# EAGLE schematic Module_DIO (EAGLE 9.2.1)

## Sheet 1 of 3
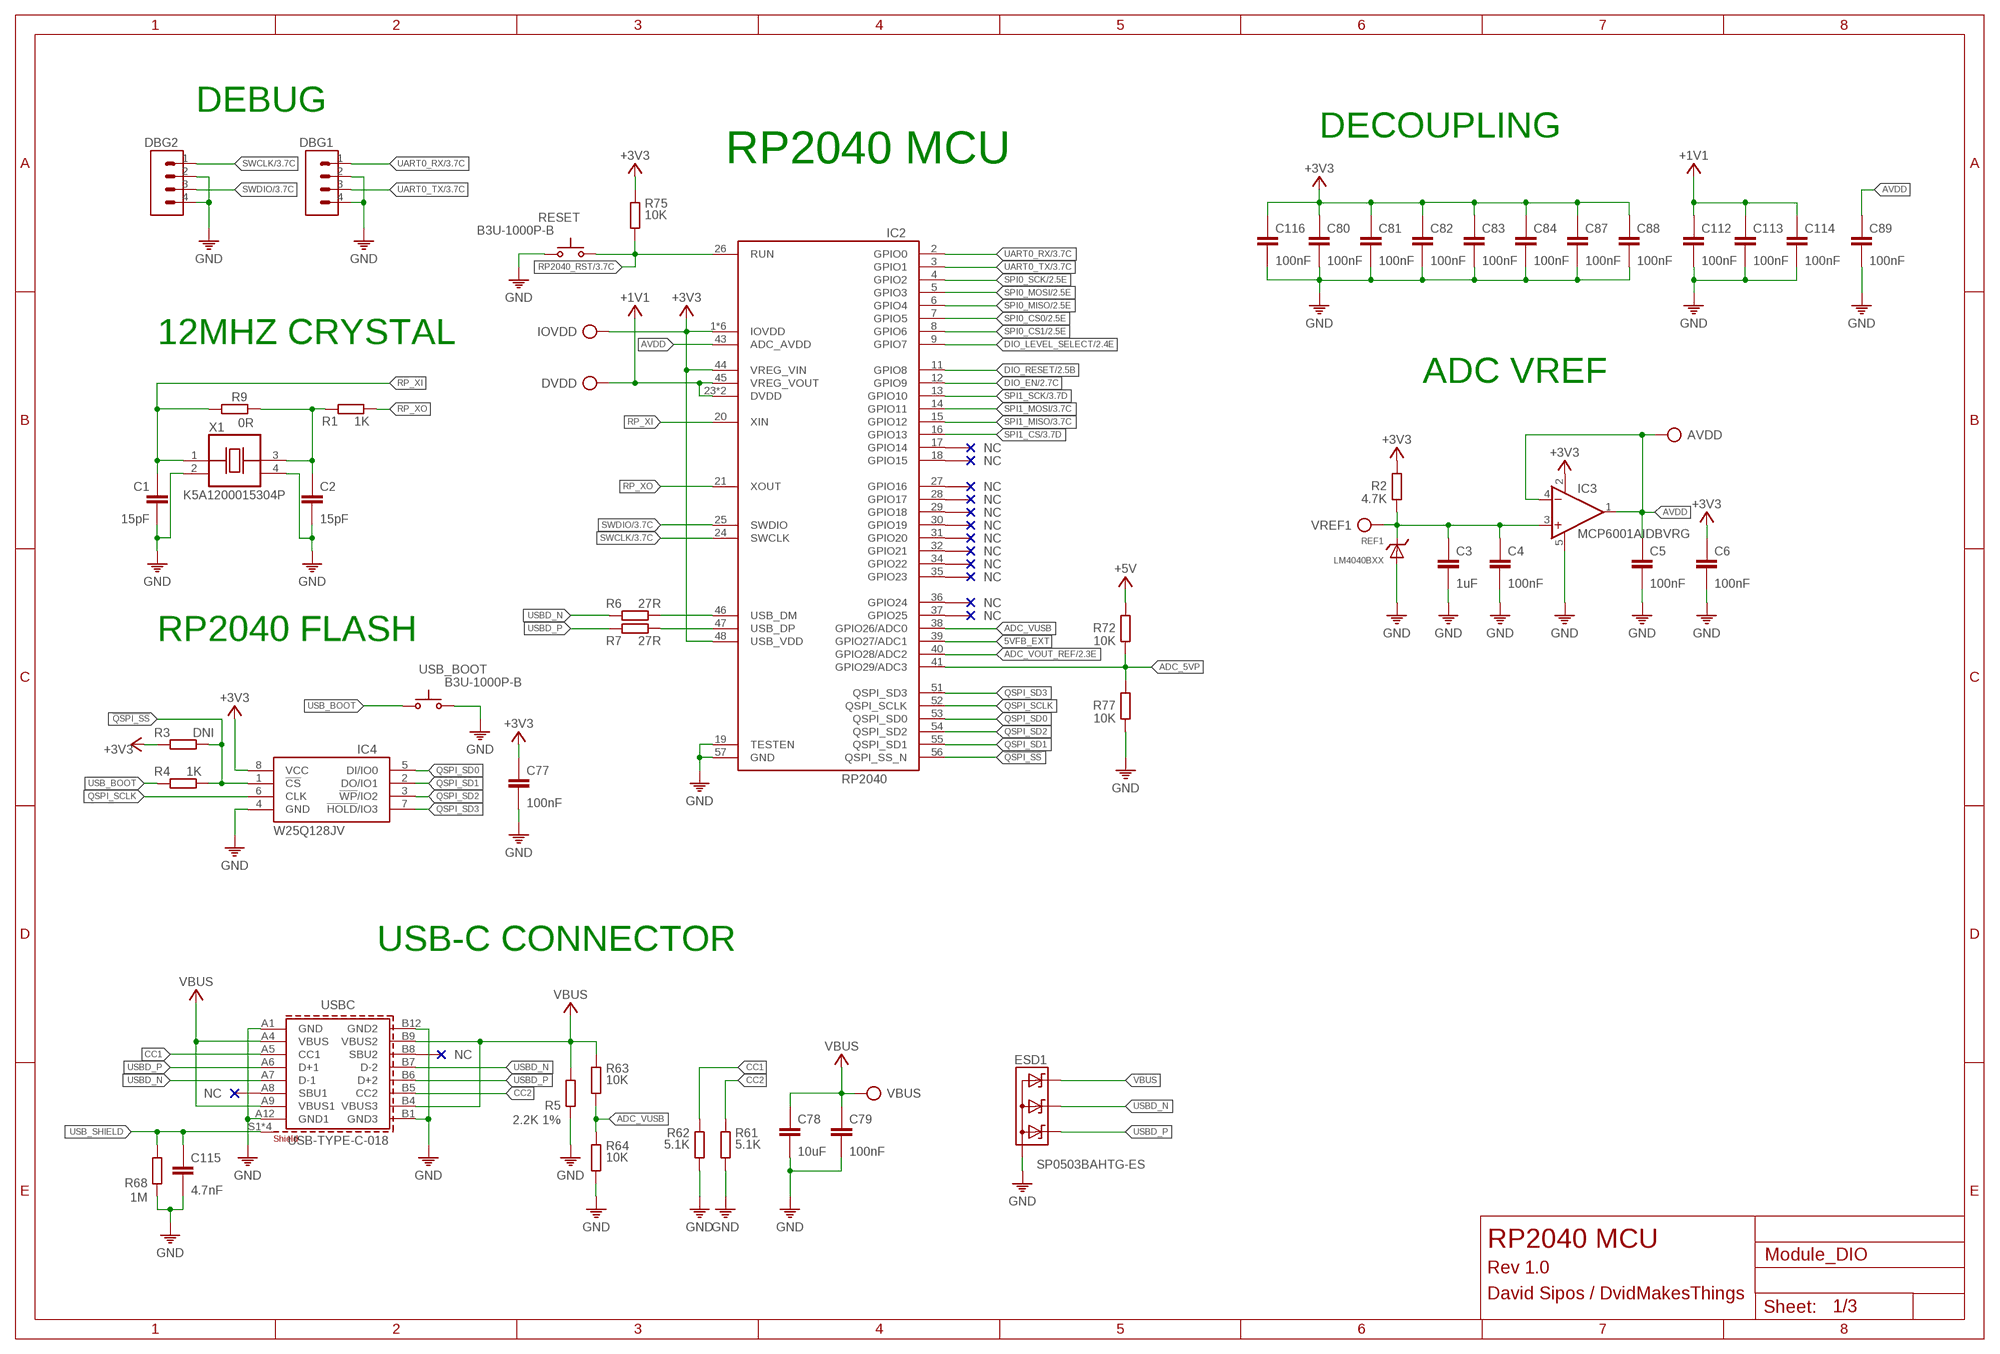
[diagram p0: schematic, sheet 1]

### Parts
AVDD  TP  [TP]
C1  15pF  C-0402  [C0402]
C2  15pF  C-0402  [C0402]
C3  1uF  C-0402  [C0402]
C4  100nF  C-0402  [C0402]
C5  100nF  C-0402  [C0402]
C6  100nF  C-0402  [C0402]
C77  100nF  C-0402  [C0402]
C78  10uF  C0805  [0805]
C79  100nF  C0402  [0402]
C80  100nF  C-0402  [C0402]
C81  100nF  C-0402  [C0402]
C82  100nF  C-0402  [C0402]
C83  100nF  C-0402  [C0402]
C84  100nF  C-0402  [C0402]
C87  100nF  C-0402  [C0402]
C88  100nF  C-0402  [C0402]
C89  100nF  C-0402  [C0402]
C112  100nF  C-0402  [C0402]
C113  100nF  C-0402  [C0402]
C114  100nF  C-0402  [C0402]
C115  4.7nF  C0402  [0402]
C116  100nF  C-0402  [C0402]
DBG1  CON-1X4  [1X4]
DBG2  CON-1X4  [1X4]
DVDD  TP  [TP]
ESD1  SP0503BAHTG-ES  SP0503BAHT  [SOT143]
IC2  RP2040  [QFN40P700X700X100-57T510]
IC3  MCP6001AIDBVRG  MCP6001RT  [SOT23-5]
IC4  W25Q128JVPIQ  W25Q128JVP  [SON127P600X500X75-8N]
IOVDD  TP  [TP]
R1  1K  R0402  [0402]
R2  4.7K  R0402  [0402]
R3  DNI  R0402  [0402]
R4  1K  R0402  [0402]
R5  2.2K 1%  R0402  [0402]
R6  27R  R0402  [0402]
R7  27R  R0402  [0402]
R9  0R  R0402  [0402]
R61  5.1K  R0402  [0402]
R62  5.1K  R0402  [0402]
R63  10K  R0402  [0402]
R64  10K  R0402  [0402]
R68  1M  R0402  [0402]
R72  10K  R0402  [0402]
R75  10K  R0402  [0402]
R77  10K  R0402  [0402]
REF1  LM4040BXX  [SOT23]
RESET  B3U-1000P-B  SWITCH-OMRON_B3U-1000P  [SWITCH-OMRON_B3U-1000P]
USB_BOOT  B3U-1000P-B  SWITCH-OMRON_B3U-1000P  [SWITCH-OMRON_B3U-1000P]
USBC  USB-TYPE-C-018  629722000214  [629722000214]
VBUS  TP  [TP]
VREF1  TP  [TP]
X1  K5A1200015304P  CRYSTAL  [OSCCC500X320X130]

### Nets
5VFB_EXT: IC2.39(GPIO27/ADC1)
!QSPI_SS: IC2.56(QSPI_SS_N) IC4.1(!CS) R3.1 R4.2
+1V1: C112.1 C113.1 C114.1 DVDD.TP IC2.23(DVDD) IC2.45(VREG_VOUT) IC2.50(DVDD)
+3V3: C6.1 C77.1 C80.1 C81.1 C82.1 C83.1 C84.1 C87.1 C88.1 C116.1 IC2.1(IOVDD) IC2.10(IOVDD) IC2.22(IOVDD) IC2.33(IOVDD) IC2.42(IOVDD) IC2.44(VREG_VIN) IC2.48(USB_VDD) IC2.49(IOVDD) IC3.2(V+) IC4.8(VCC) IOVDD.TP R2.2 R3.2 R75.1 ; also sheet 2,3
+5V: R72.2 ; also sheet 2,3
ADC_5VP: IC2.41(GPIO29/ADC3) R72.1 R77.2
ADC_VOUT_REF: IC2.40(GPIO28/ADC2) ; also sheet 2
ADC_VUSB: IC2.38(GPIO26/ADC0) R63.2 R64.1
AVDD: AVDD.TP C5.1 C89.1 IC2.43(ADC_AVDD) IC3.1(OUT) IC3.4(-IN)
CC1: R62.1 USBC.A5(CC1)
CC2: R61.1 USBC.B5(CC2)
DIO_EN: IC2.12(GPIO9) ; also sheet 2,3
DIO_LEVEL_SELECT: IC2.9(GPIO7) ; also sheet 2,3
DIO_RESET: IC2.11(GPIO8) ; also sheet 2,3
GND: C1.2 C2.2 C3.2 C4.2 C5.2 C6.2 C77.2 C78.2 C79.2 C80.2 C81.2 C82.2 C83.2 C84.2 C87.2 C88.2 C89.2 C112.2 C113.2 C114.2 C115.2 C116.2 DBG1.2 DBG1.4 DBG2.2 DBG2.4 ESD1.1(A) IC2.19(TESTEN) IC2.57(GND) IC3.5(V-) IC4.4(GND) R5.2 R61.2 R62.2 R64.2 R68.2 R77.1 REF1.2(A) REF1.3(A) RESET.2(S) USB_BOOT.2(S) USBC.A1(GND) USBC.A12(GND1) USBC.B1(GND3) USBC.B12(GND2) X1.2(VSS) X1.4(VDD) ; also sheet 2,3
N$1: C2.1 R1.1 R9.2 X1.3(OUT)
QSPI_SCLK: IC2.52(QSPI_SCLK) IC4.6(CLK)
QSPI_SD0: IC2.53(QSPI_SD0) IC4.5(DI/IO0)
QSPI_SD1: IC2.55(QSPI_SD1) IC4.2(DO/IO1)
QSPI_SD2: IC2.54(QSPI_SD2) IC4.3(!WP!/IO2)
QSPI_SD3: IC2.51(QSPI_SD3) IC4.7(!HOLD!/IO3)
RP2040_RST: IC2.26(RUN) R75.2 RESET.1(P) ; also sheet 3
RP_USBD_N [90R_DIFFPAIR]: IC2.46(USB_DM) R6.2
RP_USBD_P [90R_DIFFPAIR]: IC2.47(USB_DP) R7.2
RP_XI: C1.1 IC2.20(XIN) R9.1 X1.1(CON)
RP_XO: IC2.21(XOUT) R1.2
SPI0_CS0: IC2.7(GPIO5) ; also sheet 2,3
SPI0_CS1: IC2.8(GPIO6) ; also sheet 2,3
SPI0_MISO: IC2.6(GPIO4) ; also sheet 2,3
SPI0_MOSI: IC2.5(GPIO3) ; also sheet 2,3
SPI0_SCK: IC2.4(GPIO2) ; also sheet 2,3
SPI1_CS: IC2.16(GPIO13) ; also sheet 3
SPI1_MISO: IC2.15(GPIO12) ; also sheet 3
SPI1_MOSI: IC2.14(GPIO11) ; also sheet 3
SPI1_SCK: IC2.13(GPIO10) ; also sheet 3
SWCLK: DBG2.1 IC2.24(SWCLK) ; also sheet 3
SWDIO: DBG2.3 IC2.25(SWDIO) ; also sheet 3
UART0_RX: DBG1.1 IC2.2(GPIO0) ; also sheet 3
UART0_TX: DBG1.3 IC2.3(GPIO1) ; also sheet 3
USB_BOOT: R4.1 USB_BOOT.1(P)
USB_SHIELD: C115.1 R68.1 USBC.S1(SHIELD) USBC.S2(SHIELD) USBC.S3(SHIELD) USBC.S4(SHIELD)
USBD_N [90R_DIFFPAIR]: ESD1.3(C2) R6.1 USBC.A7(D-1) USBC.B7(D-2)
USBD_P [90R_DIFFPAIR]: ESD1.2(C1) R7.1 USBC.A6(D+1) USBC.B6(D+2)
VBUS: C78.1 C79.1 ESD1.4(C3) R5.1 R63.1 USBC.A4(VBUS) USBC.A9(VBUS1) USBC.B4(VBUS3) USBC.B9(VBUS2) VBUS.TP ; also sheet 3
VREF: C3.1 C4.1 IC3.3(+IN) R2.1 REF1.1(C) VREF1.TP
Unconnected: IC2.17(GPIO14) IC2.18(GPIO15) IC2.27(GPIO16) IC2.28(GPIO17) IC2.29(GPIO18) IC2.30(GPIO19) IC2.31(GPIO20) IC2.32(GPIO21) IC2.34(GPIO22) IC2.35(GPIO23) IC2.36(GPIO24) IC2.37(GPIO25) USBC.A8(SBU1) USBC.B8(SBU2)

### Notes on the sheet
- DEBUG
- DECOUPLING
- RP2040 MCU
- 12MHZ CRYSTAL
- ADC VREF
- RP2040 FLASH
- USB-C CONNECTOR
- RP2040 MCU
- Rev 1.0
- David Sipos / DvidMakesThings

## Sheet 2 of 3: DIGITAL IO
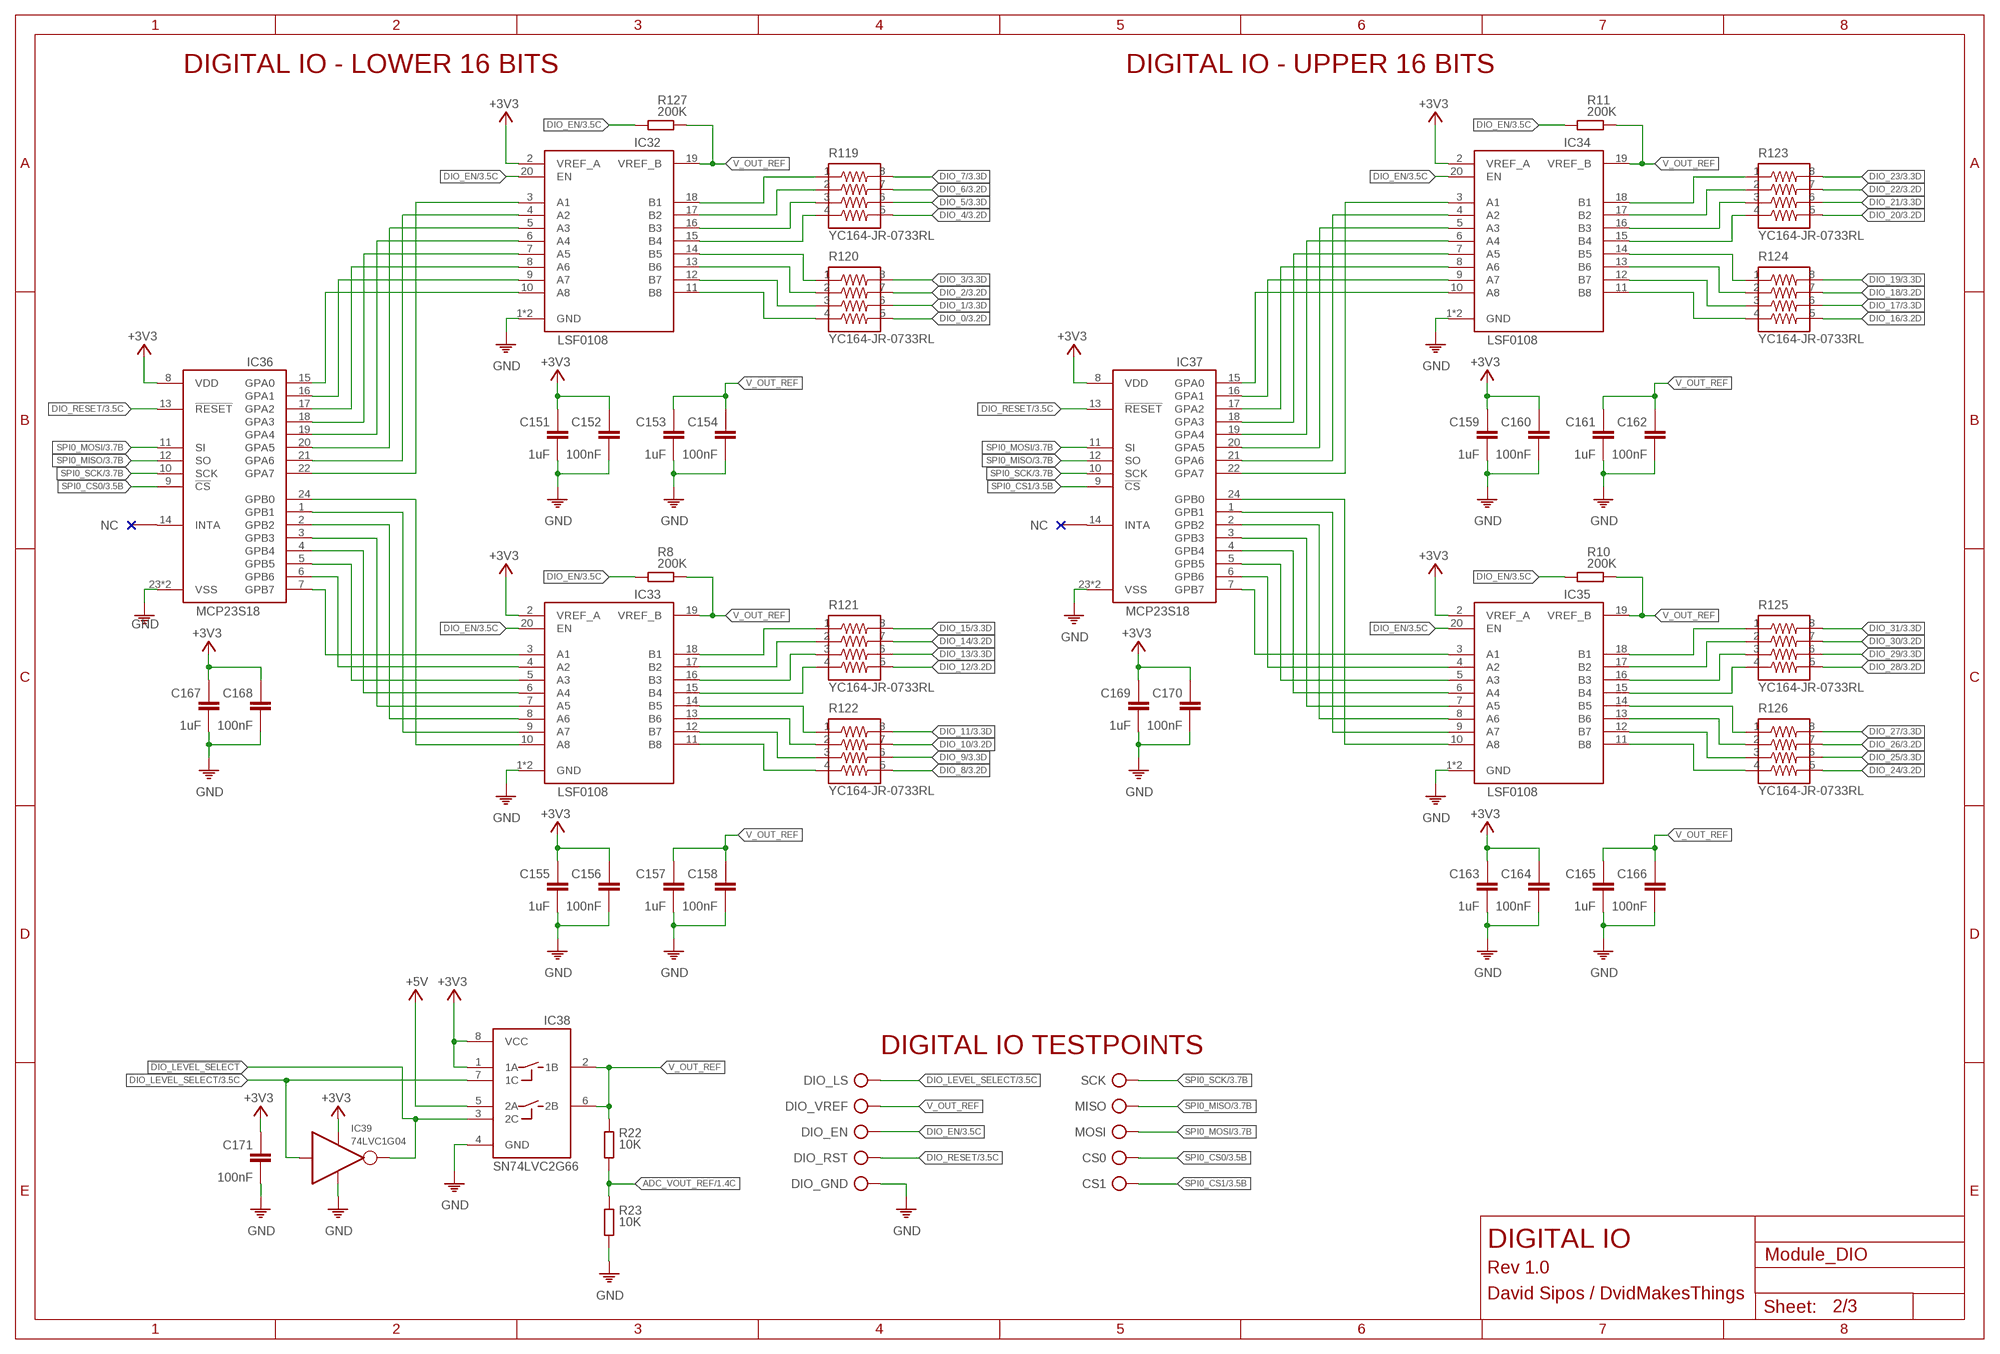
[diagram p1: schematic, sheet 2]

### Parts
C151  1uF  C-0402  [C0402]
C152  100nF  C-0402  [C0402]
C153  1uF  C-0402  [C0402]
C154  100nF  C-0402  [C0402]
C155  1uF  C-0402  [C0402]
C156  100nF  C-0402  [C0402]
C157  1uF  C-0402  [C0402]
C158  100nF  C-0402  [C0402]
C159  1uF  C-0402  [C0402]
C160  100nF  C-0402  [C0402]
C161  1uF  C-0402  [C0402]
C162  100nF  C-0402  [C0402]
C163  1uF  C-0402  [C0402]
C164  100nF  C-0402  [C0402]
C165  1uF  C-0402  [C0402]
C166  100nF  C-0402  [C0402]
C167  1uF  C-0402  [C0402]
C168  100nF  C-0402  [C0402]
C169  1uF  C-0402  [C0402]
C170  100nF  C-0402  [C0402]
C171  100nF  C-0603  [C0603]
CS0  TP  [TP]
CS1  TP  [TP]
DIO_EN  TP  [TP]
DIO_GND  TP  [TP]
DIO_LS  TP  [TP]
DIO_RST  TP  [TP]
DIO_VREF  TP  [TP]
IC32  LSF0108  LSF0108-Q1  [VQFN20]
IC33  LSF0108  LSF0108-Q1  [VQFN20]
IC34  LSF0108  LSF0108-Q1  [VQFN20]
IC35  LSF0108  LSF0108-Q1  [VQFN20]
IC36  MCP23S18  [QFN50P400X400X100-25T265]
IC37  MCP23S18  [QFN50P400X400X100-25T265]
IC38  SN74LVC2G66  [SOP50P310X90-8N]
IC39  74LVC1G04  [SOT95P280X145-5N]
MISO  TP  [TP]
MOSI  TP  [TP]
R8  200K  R0402  [0402]
R10  200K  R0402  [0402]
R11  200K  R0402  [0402]
R22  10K  R0402  [0402]
R23  10K  R0402  [0402]
R119  YC164-JR-0733RL  [YC164-JR-0733RL]
R120  YC164-JR-0733RL  [YC164-JR-0733RL]
R121  YC164-JR-0733RL  [YC164-JR-0733RL]
R122  YC164-JR-0733RL  [YC164-JR-0733RL]
R123  YC164-JR-0733RL  [YC164-JR-0733RL]
R124  YC164-JR-0733RL  [YC164-JR-0733RL]
R125  YC164-JR-0733RL  [YC164-JR-0733RL]
R126  YC164-JR-0733RL  [YC164-JR-0733RL]
R127  200K  R0402  [0402]
SCK  TP  [TP]

### Nets
!DIO_LEVEL_SELECT: IC38.3(2C) IC39.4(OUT)
+3V3: C151.1 C152.1 C155.1 C156.1 C159.1 C160.1 C163.1 C164.1 C167.1 C168.1 C169.1 C170.1 C171.1 IC32.2(VREF_A) IC33.2(VREF_A) IC34.2(VREF_A) IC35.2(VREF_A) IC36.8(VDD) IC37.8(VDD) IC38.1(1A) IC38.8(VCC) IC39.5(V+) ; also sheet 1,3
+5V: IC38.5(2A) ; also sheet 1,3
ADC_VOUT_REF: R22.2 R23.1 ; also sheet 1
DIO_0: R120.5 ; also sheet 3
DIO_1: R120.6 ; also sheet 3
DIO_2: R120.7 ; also sheet 3
DIO_3: R120.8 ; also sheet 3
DIO_4: R119.5 ; also sheet 3
DIO_5: R119.6 ; also sheet 3
DIO_6: R119.7 ; also sheet 3
DIO_7: R119.8 ; also sheet 3
DIO_8: R122.5 ; also sheet 3
DIO_9: R122.6 ; also sheet 3
DIO_10: R122.7 ; also sheet 3
DIO_11: R122.8 ; also sheet 3
DIO_12: R121.5 ; also sheet 3
DIO_13: R121.6 ; also sheet 3
DIO_14: R121.7 ; also sheet 3
DIO_15: R121.8 ; also sheet 3
DIO_16: R124.5 ; also sheet 3
DIO_17: R124.6 ; also sheet 3
DIO_18: R124.7 ; also sheet 3
DIO_19: R124.8 ; also sheet 3
DIO_20: R123.5 ; also sheet 3
DIO_21: R123.6 ; also sheet 3
DIO_22: R123.7 ; also sheet 3
DIO_23: R123.8 ; also sheet 3
DIO_24: R126.5 ; also sheet 3
DIO_25: R126.6 ; also sheet 3
DIO_26: R126.7 ; also sheet 3
DIO_27: R126.8 ; also sheet 3
DIO_28: R125.5 ; also sheet 3
DIO_29: R125.6 ; also sheet 3
DIO_30: R125.7 ; also sheet 3
DIO_31: R125.8 ; also sheet 3
DIO_EN: DIO_EN.TP IC32.20(EN) IC33.20(EN) IC34.20(EN) IC35.20(EN) R8.2 R10.2 R11.2 R127.2 ; also sheet 1,3
DIO_LEVEL_SELECT: DIO_LS.TP IC38.7(1C) IC39.2(IN) ; also sheet 1,3
DIO_RESET: DIO_RST.TP IC36.13(!RESET) IC37.13(!RESET) ; also sheet 1,3
GND: C151.2 C152.2 C153.2 C154.2 C155.2 C156.2 C157.2 C158.2 C159.2 C160.2 C161.2 C162.2 C163.2 C164.2 C165.2 C166.2 C167.2 C168.2 C169.2 C170.2 C171.2 DIO_GND.TP IC32.1(GND) IC32.PAD(GND) IC33.1(GND) IC33.PAD(GND) IC34.1(GND) IC34.PAD(GND) IC35.1(GND) IC35.PAD(GND) IC36.23(VSS) IC36.25(VSS) IC37.23(VSS) IC37.25(VSS) IC38.4(GND) IC39.3(V-) R23.2 ; also sheet 1,3
N$29: IC33.9(A7) IC36.1(GPB1)
N$61: IC32.10(A8) IC36.15(GPA0)
N$62: IC32.9(A7) IC36.16(GPA1)
N$63: IC32.8(A6) IC36.17(GPA2)
N$64: IC32.7(A5) IC36.18(GPA3)
N$65: IC32.6(A4) IC36.19(GPA4)
N$66: IC32.5(A3) IC36.20(GPA5)
N$67: IC32.4(A2) IC36.21(GPA6)
N$68: IC32.3(A1) IC36.22(GPA7)
N$69: IC32.18(B1) R119.1
N$70: IC32.17(B2) R119.2
N$71: IC32.16(B3) R119.3
N$72: IC32.15(B4) R119.4
N$73: IC32.14(B5) R120.1
N$74: IC32.13(B6) R120.2
N$75: IC32.12(B7) R120.3
N$76: IC32.11(B8) R120.4
N$77: IC33.10(A8) IC36.24(GPB0)
N$78: IC33.8(A6) IC36.2(GPB2)
N$79: IC33.7(A5) IC36.3(GPB3)
N$80: IC33.6(A4) IC36.4(GPB4)
N$81: IC33.5(A3) IC36.5(GPB5)
N$82: IC33.4(A2) IC36.6(GPB6)
N$83: IC33.3(A1) IC36.7(GPB7)
N$84: IC33.18(B1) R121.1
N$85: IC33.17(B2) R121.2
N$86: IC33.16(B3) R121.3
N$87: IC33.15(B4) R121.4
N$88: IC33.14(B5) R122.1
N$89: IC33.13(B6) R122.2
N$90: IC33.12(B7) R122.3
N$91: IC33.11(B8) R122.4
N$92: IC34.10(A8) IC37.15(GPA0)
N$93: IC34.9(A7) IC37.16(GPA1)
N$94: IC34.8(A6) IC37.17(GPA2)
N$95: IC34.7(A5) IC37.18(GPA3)
N$96: IC34.6(A4) IC37.19(GPA4)
N$97: IC34.5(A3) IC37.20(GPA5)
N$98: IC34.4(A2) IC37.21(GPA6)
N$99: IC34.3(A1) IC37.22(GPA7)
N$100: IC34.18(B1) R123.1
N$101: IC34.17(B2) R123.2
N$102: IC34.16(B3) R123.3
N$103: IC34.15(B4) R123.4
N$104: IC34.14(B5) R124.1
N$105: IC34.13(B6) R124.2
N$106: IC34.12(B7) R124.3
N$107: IC34.11(B8) R124.4
N$108: IC35.8(A6) IC37.2(GPB2)
N$109: IC35.7(A5) IC37.3(GPB3)
N$110: IC35.6(A4) IC37.4(GPB4)
N$111: IC35.5(A3) IC37.5(GPB5)
N$112: IC35.4(A2) IC37.6(GPB6)
N$113: IC35.3(A1) IC37.7(GPB7)
N$114: IC35.9(A7) IC37.1(GPB1)
N$115: IC35.10(A8) IC37.24(GPB0)
N$116: IC35.18(B1) R125.1
N$117: IC35.17(B2) R125.2
N$118: IC35.16(B3) R125.3
N$119: IC35.15(B4) R125.4
N$120: IC35.14(B5) R126.1
N$121: IC35.13(B6) R126.2
N$122: IC35.12(B7) R126.3
N$123: IC35.11(B8) R126.4
SPI0_CS0: CS0.TP IC36.9(!CS) ; also sheet 1,3
SPI0_CS1: CS1.TP IC37.9(!CS) ; also sheet 1,3
SPI0_MISO: IC36.12(SO) IC37.12(SO) MISO.TP ; also sheet 1,3
SPI0_MOSI: IC36.11(SI) IC37.11(SI) MOSI.TP ; also sheet 1,3
SPI0_SCK: IC36.10(SCK) IC37.10(SCK) SCK.TP ; also sheet 1,3
V_OUT_REF: C153.1 C154.1 C157.1 C158.1 C161.1 C162.1 C165.1 C166.1 DIO_VREF.TP IC32.19(VREF_B) IC33.19(VREF_B) IC34.19(VREF_B) IC35.19(VREF_B) IC38.2(1B) IC38.6(2B) R8.1 R10.1 R11.1 R22.1 R127.1
Unconnected: IC36.14(INTA) IC37.14(INTA)

### Notes on the sheet
- DIGITAL IO - LOWER 16 BITS | DIGITAL IO - UPPER 16 BITS
- DIGITAL IO TESTPOINTS
- DIGITAL IO
- Rev 1.0
- David Sipos / DvidMakesThings

## Sheet 3 of 3
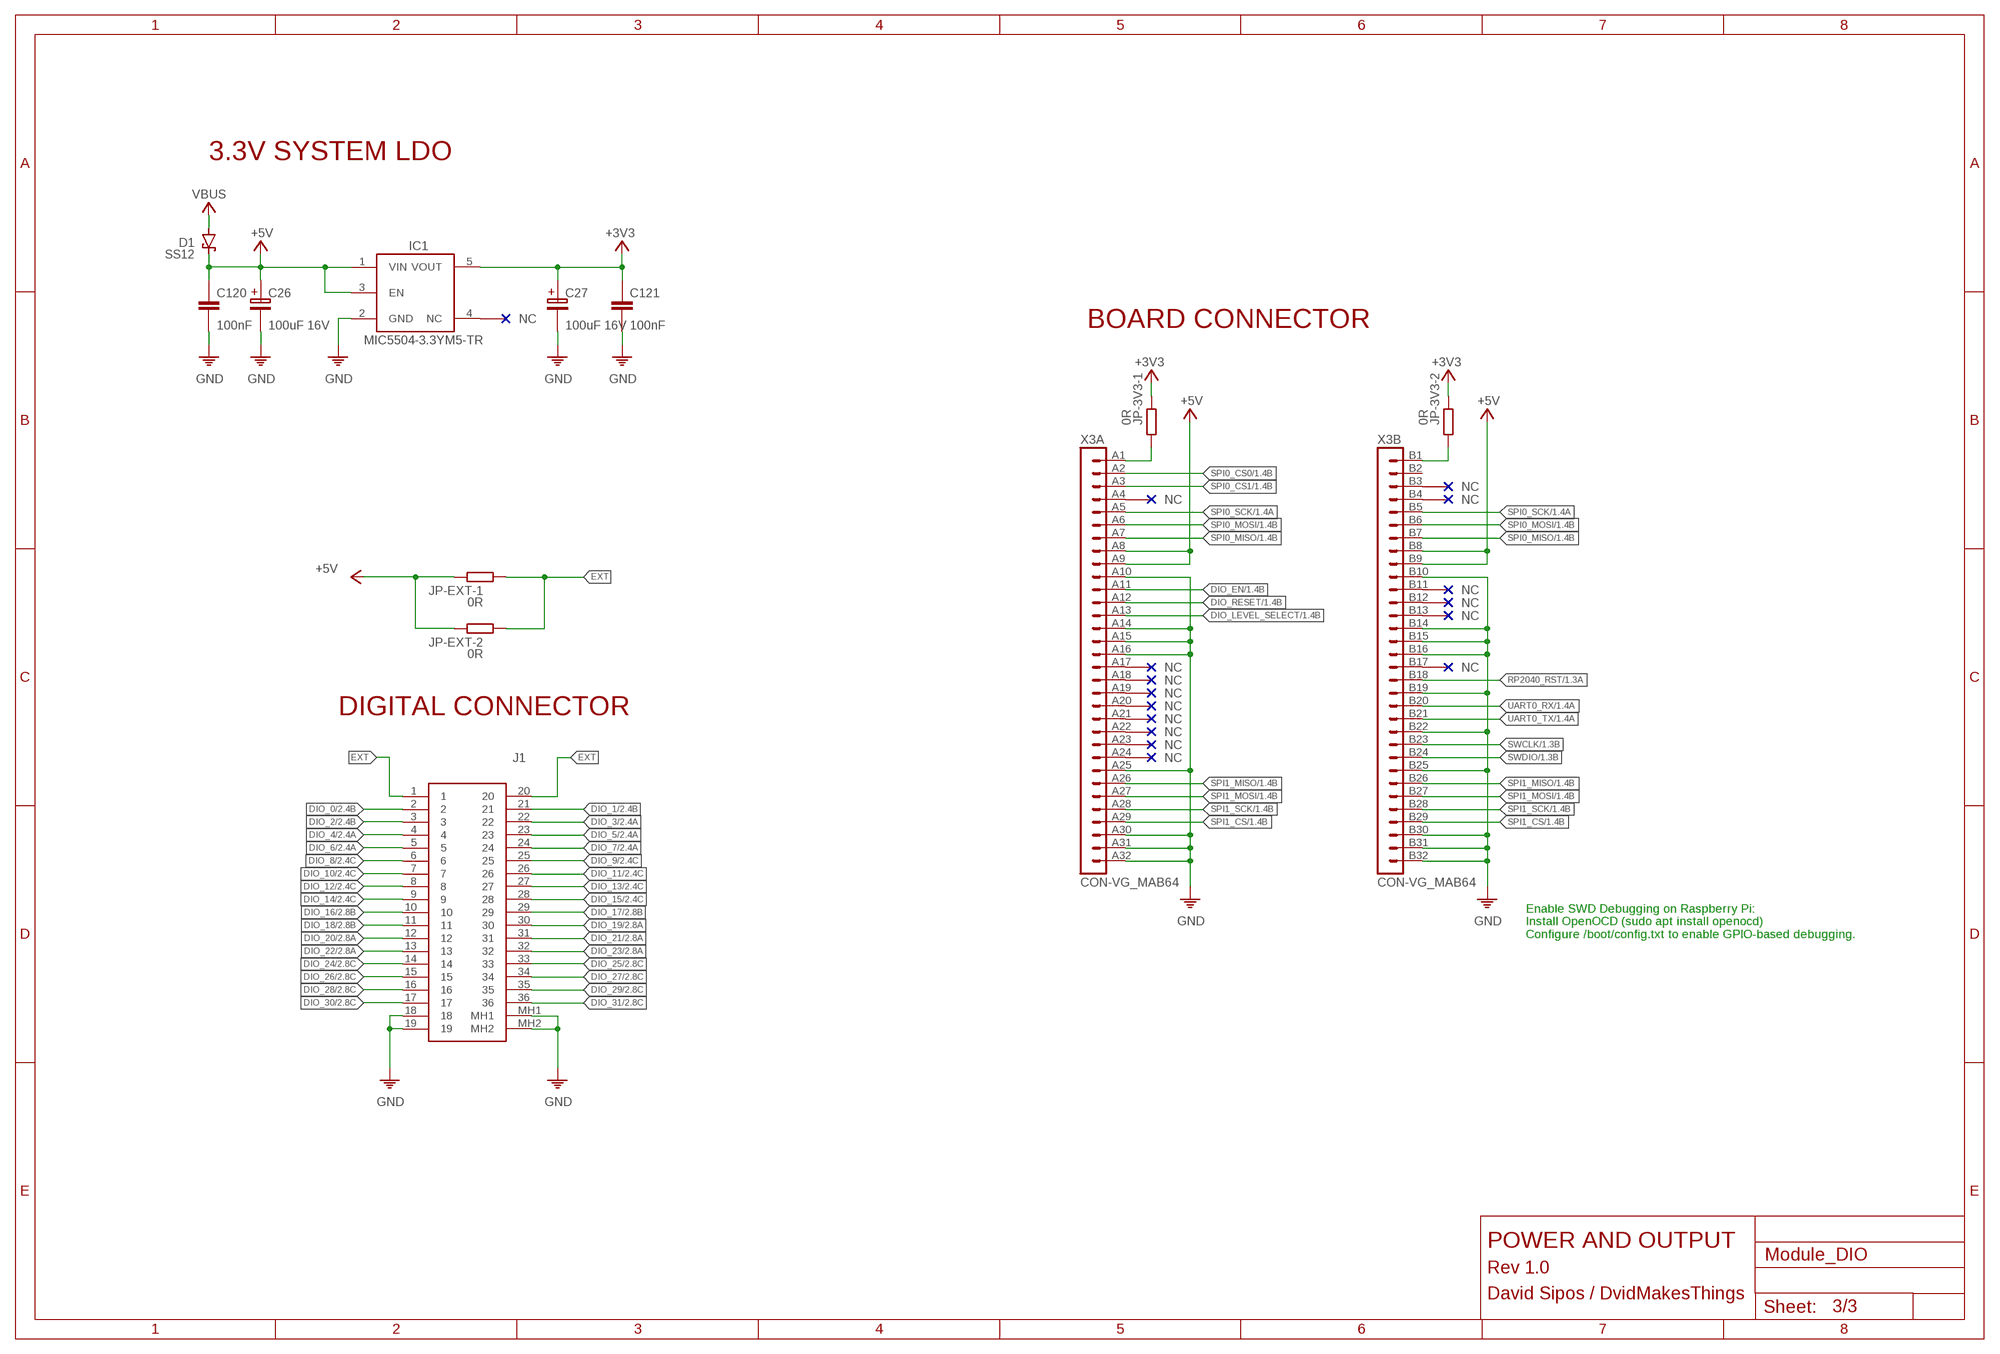
[diagram p2: schematic, sheet 3]

### Parts
C26  100uF 16V  CPOL  [100UF-16V]
C27  100uF 16V  CPOL  [100UF-16V]
C120  100nF  C-0402  [C0402]
C121  100nF  C-0402  [C0402]
D1  SS12  [SMA]
IC1  MIC5504-3.3YM5-TR  [SOT23-5]
J1  N10236-52B3PC  [MDB36]
JP-3V3-1  0R  R0603  [0603]
JP-3V3-2  0R  R0603  [0603]
JP-EXT-1  0R  R0603  [0603]
JP-EXT-2  0R  R0603  [0603]
X3  CON-VG_MAB64  [CON-VG_MAB64]

### Nets
+3V3: C27.1 C121.1 IC1.5(VOUT) JP-3V3-1.1 JP-3V3-2.1 ; also sheet 1,2
+5V: C26.1 C120.1 D1.C IC1.1(VIN) IC1.3(EN) JP-EXT-1.1 JP-EXT-2.1 X3.A8 X3.A9 X3.B8 X3.B9 ; also sheet 1,2
DIO_0: J1.2 ; also sheet 2
DIO_1: J1.21 ; also sheet 2
DIO_2: J1.3 ; also sheet 2
DIO_3: J1.22 ; also sheet 2
DIO_4: J1.4 ; also sheet 2
DIO_5: J1.23 ; also sheet 2
DIO_6: J1.5 ; also sheet 2
DIO_7: J1.24 ; also sheet 2
DIO_8: J1.6 ; also sheet 2
DIO_9: J1.25 ; also sheet 2
DIO_10: J1.7 ; also sheet 2
DIO_11: J1.26 ; also sheet 2
DIO_12: J1.8 ; also sheet 2
DIO_13: J1.27 ; also sheet 2
DIO_14: J1.9 ; also sheet 2
DIO_15: J1.28 ; also sheet 2
DIO_16: J1.10 ; also sheet 2
DIO_17: J1.29 ; also sheet 2
DIO_18: J1.11 ; also sheet 2
DIO_19: J1.30 ; also sheet 2
DIO_20: J1.12 ; also sheet 2
DIO_21: J1.31 ; also sheet 2
DIO_22: J1.13 ; also sheet 2
DIO_23: J1.32 ; also sheet 2
DIO_24: J1.14 ; also sheet 2
DIO_25: J1.33 ; also sheet 2
DIO_26: J1.15 ; also sheet 2
DIO_27: J1.34 ; also sheet 2
DIO_28: J1.16 ; also sheet 2
DIO_29: J1.35 ; also sheet 2
DIO_30: J1.17 ; also sheet 2
DIO_31: J1.36 ; also sheet 2
DIO_EN: X3.A11 ; also sheet 1,2
DIO_LEVEL_SELECT: X3.A13 ; also sheet 1,2
DIO_RESET: X3.A12 ; also sheet 1,2
EXT: J1.1 J1.20 JP-EXT-1.2 JP-EXT-2.2
GND: C26.2 C27.2 C120.2 C121.2 IC1.2(GND) J1.18 J1.19 J1.MH1 J1.MH2 X3.A10 X3.A14 X3.A15 X3.A16 X3.A25 X3.A30 X3.A31 X3.A32 X3.B10 X3.B14 X3.B15 X3.B16 X3.B19 X3.B22 X3.B25 X3.B30 X3.B31 X3.B32 ; also sheet 1,2
N$2: JP-3V3-2.2 X3.B1
N$4: JP-3V3-1.2 X3.A1
RP2040_RST: X3.B18 ; also sheet 1
SPI0_CS0: X3.A2 ; also sheet 1,2
SPI0_CS1: X3.A3 ; also sheet 1,2
SPI0_MISO: X3.A7 X3.B7 ; also sheet 1,2
SPI0_MOSI: X3.A6 X3.B6 ; also sheet 1,2
SPI0_SCK: X3.A5 X3.B5 ; also sheet 1,2
SPI1_CS: X3.A29 X3.B29 ; also sheet 1
SPI1_MISO: X3.A26 X3.B26 ; also sheet 1
SPI1_MOSI: X3.A27 X3.B27 ; also sheet 1
SPI1_SCK: X3.A28 X3.B28 ; also sheet 1
SWCLK: X3.B23 ; also sheet 1
SWDIO: X3.B24 ; also sheet 1
UART0_RX: X3.B20 ; also sheet 1
UART0_TX: X3.B21 ; also sheet 1
VBUS: D1.A ; also sheet 1
Unconnected: IC1.4(NC) X3.A4 X3.A17 X3.A18 X3.A19 X3.A20 X3.A21 X3.A22 X3.A23 X3.A24 X3.B2 X3.B3 X3.B4 X3.B11 X3.B12 X3.B13 X3.B17

### Notes on the sheet
- 3.3V SYSTEM LDO
- BOARD CONNECTOR
- DIGITAL CONNECTOR
- Enable SWD Debugging on Raspberry Pi:
  Install OpenOCD (sudo apt install openocd)
  Configure /boot/config.txt to enable GPIO-based debugging.
- POWER AND OUTPUT
- Rev 1.0
- David Sipos / DvidMakesThings

## Library data of the parts
AVDD CS0 CS1 DIO_EN DIO_GND DIO_LS DIO_RST DIO_VREF DVDD IOVDD MISO MOSI SCK VBUS VREF1 = ds_passive:TP
C1-C6 C77-C84 C87-C89 C112-C116 C120 C121 C151-C171 = ds_passive:C
C26 C27 = ds_passive:CPOL
D1 = Diodes:SS12: DIODE SCHOTTKY 20V 1A SMA Manufacturer's datasheet <https://www.onsemi.com/pub/Collateral/SS19-D.PDF>; CREATED_BY: PCBLayout.com; DIGIKEY_PART_NUMBER: SS12FSCT-ND; MANUFACTURER: ON Semiconductor; MPN: SS12; PACKAGE: SMA (DO-214AC)
DBG1 DBG2 = ds_con:CON-1X4
ESD1 = ds_ic_peripherals:SP0503BAHT: TVS Diode Arrays Surface Mount TVS Avalanche Diode Array
IC1 = ds_ic_vreg:MIC5504-3.3YM5-TR: The MIC5501/2/3/4 is an advanced general-purpose LDO ideal for powering general-purpose portable devices. The MIC5501/2/3/4 family of products provides a high-performance 300mA LDO
IC2 = ds_ic_mcu:RP2040
IC3 = ds_ic_opa:MCP6001RT: 1 MHz, Low-Power Op Amp
IC4 = MCU:W25Q128JV: 3V 128M-BIT SERIAL FLASH MEMORY WITH DUAL/QUAD SPI & QPI & DTR
IC32-IC35 = ds_ic_peripherals:LSF0108: Automotive 8-Channel Multi-Voltage Level Translator
IC36 IC37 = ds_ic_peripherals:MCP23S18: 16-Bit I/O Expander with Open-Drain Outputs
IC38 = ds_ic_peripherals:SN74LVC2G66: Dual Bilateral Analog Switch
IC39 = ds_ic_logic:74LVC1G04: Single inverter
J1 = ds_con:N10236-52B3PC: D-Sub Micro-D Connectors 36 CON M2.5 PANEL/GROUND
JP-3V3-1 JP-3V3-2 JP-EXT-1 JP-EXT-2 R1-R11 R22 R23 R61-R64 R68 R72 R75 R77 R127 = ds_passive:R
R119-R126 = Resistor Array:YC164-JR-0733RL: RES ARRAY 4 RES 33 OHM 1206 Manufacturer's datasheet <https://www.yageo.com/upload/media/product/productsearch/datasheet/rchip/PYu-YC_TC_group_51_RoHS_L_9.pdf>; CREATED_BY: PCBLayout.com; DIGIKEY_PN: YC164J-33TR-ND; MANUFACTURER: Yageo; MPN: YC164-JR-0733RL; PACKAGE: 1206
REF1 = ds_ic_vreg:LM4040BXX: Fixed voltage, 45-µA, precision micropower shunt voltage reference
RESET USB_BOOT = 52101-101-REV-A_v16:SWITCH-OMRON_B3U-1000P: SMD Tactile Switch - Ultra Small
USBC = Wurth_Connectors_WR-USB:629722000214: WR-COM USB 2.0 Type C Receptacle Horizontal SMT Kind Properties Durability 10 000 Mating cycles Gender Receptacle Type Horizontal General Information Operating Temperature -40 up to +85 °C Electrical Properties Working Voltage 20 V (DC) Withstanding Voltage 100 V (AC) Contact Resistance 40 mΩ Material Properties Insulator Material LCP Insulator Flammability Rating UL94 V-0 Insulator Color Black Contact Material Brass Contact Plating Gold over Nickel Contact Type Stamped Shielding Material Steel Shielding Plating Nickel (Ni) <https://www.we-online.com/components/media/o689297v209%20family-wr-com-629722000214.jpg> Details see: www.we-online.com/en/components/products/WR-COM_USB_20_TYPE_C_RECEPTACLE_HORIZONTAL_SMT <www.we-online.com/catalog/WR-COM_USB_20_TYPE_C_RECEPTACLE_HORIZONTAL_SMT/?utm_source=eagle_model&utm_medium=description_link&utm_campaign=eisos_eagle> Updated by Ella Wu 2023-05-30 2023 (C) Würth Elektronik; APPLICATION: USB 2.0; DATASHEET-URL: https://www.we-online.com/redexpert/spec/629722000214?ae; GERDER: Receptacle; INTERFACE-TYPE: Type C; IR: 5A; MOUNT: SMT; PACKAGING: Tape and Reel; PART-NUMBER: 629722000214; PINS: 16; TYPE: Horizontal; VALUE: 629722000214; WORKING-VOLTAGE: 20V(AC)
X1 = ds_passive:CRYSTAL
X3 = ds_con:CON-VG_MAB64: CONNECTOR male, 94 pins, type B, rows AB, grid 2.54 mm

## Net classes
1 50R_DIFFPAIR: width 0.4 mm, drill 0.15 mm, clearance 0.203 mm
2 90R_DIFFPAIR: width 0.155 mm, drill 0.15 mm, clearance 0.191 mm
3 100R_DIFFPAIR: width 0.221 mm, drill 0.15 mm, clearance 0.203 mm